# Altium schematic sheet Motorsports_BSPD_EV.SchDoc
size 381 x 241 mm; SheetNumber: 1; SheetTotal: 1
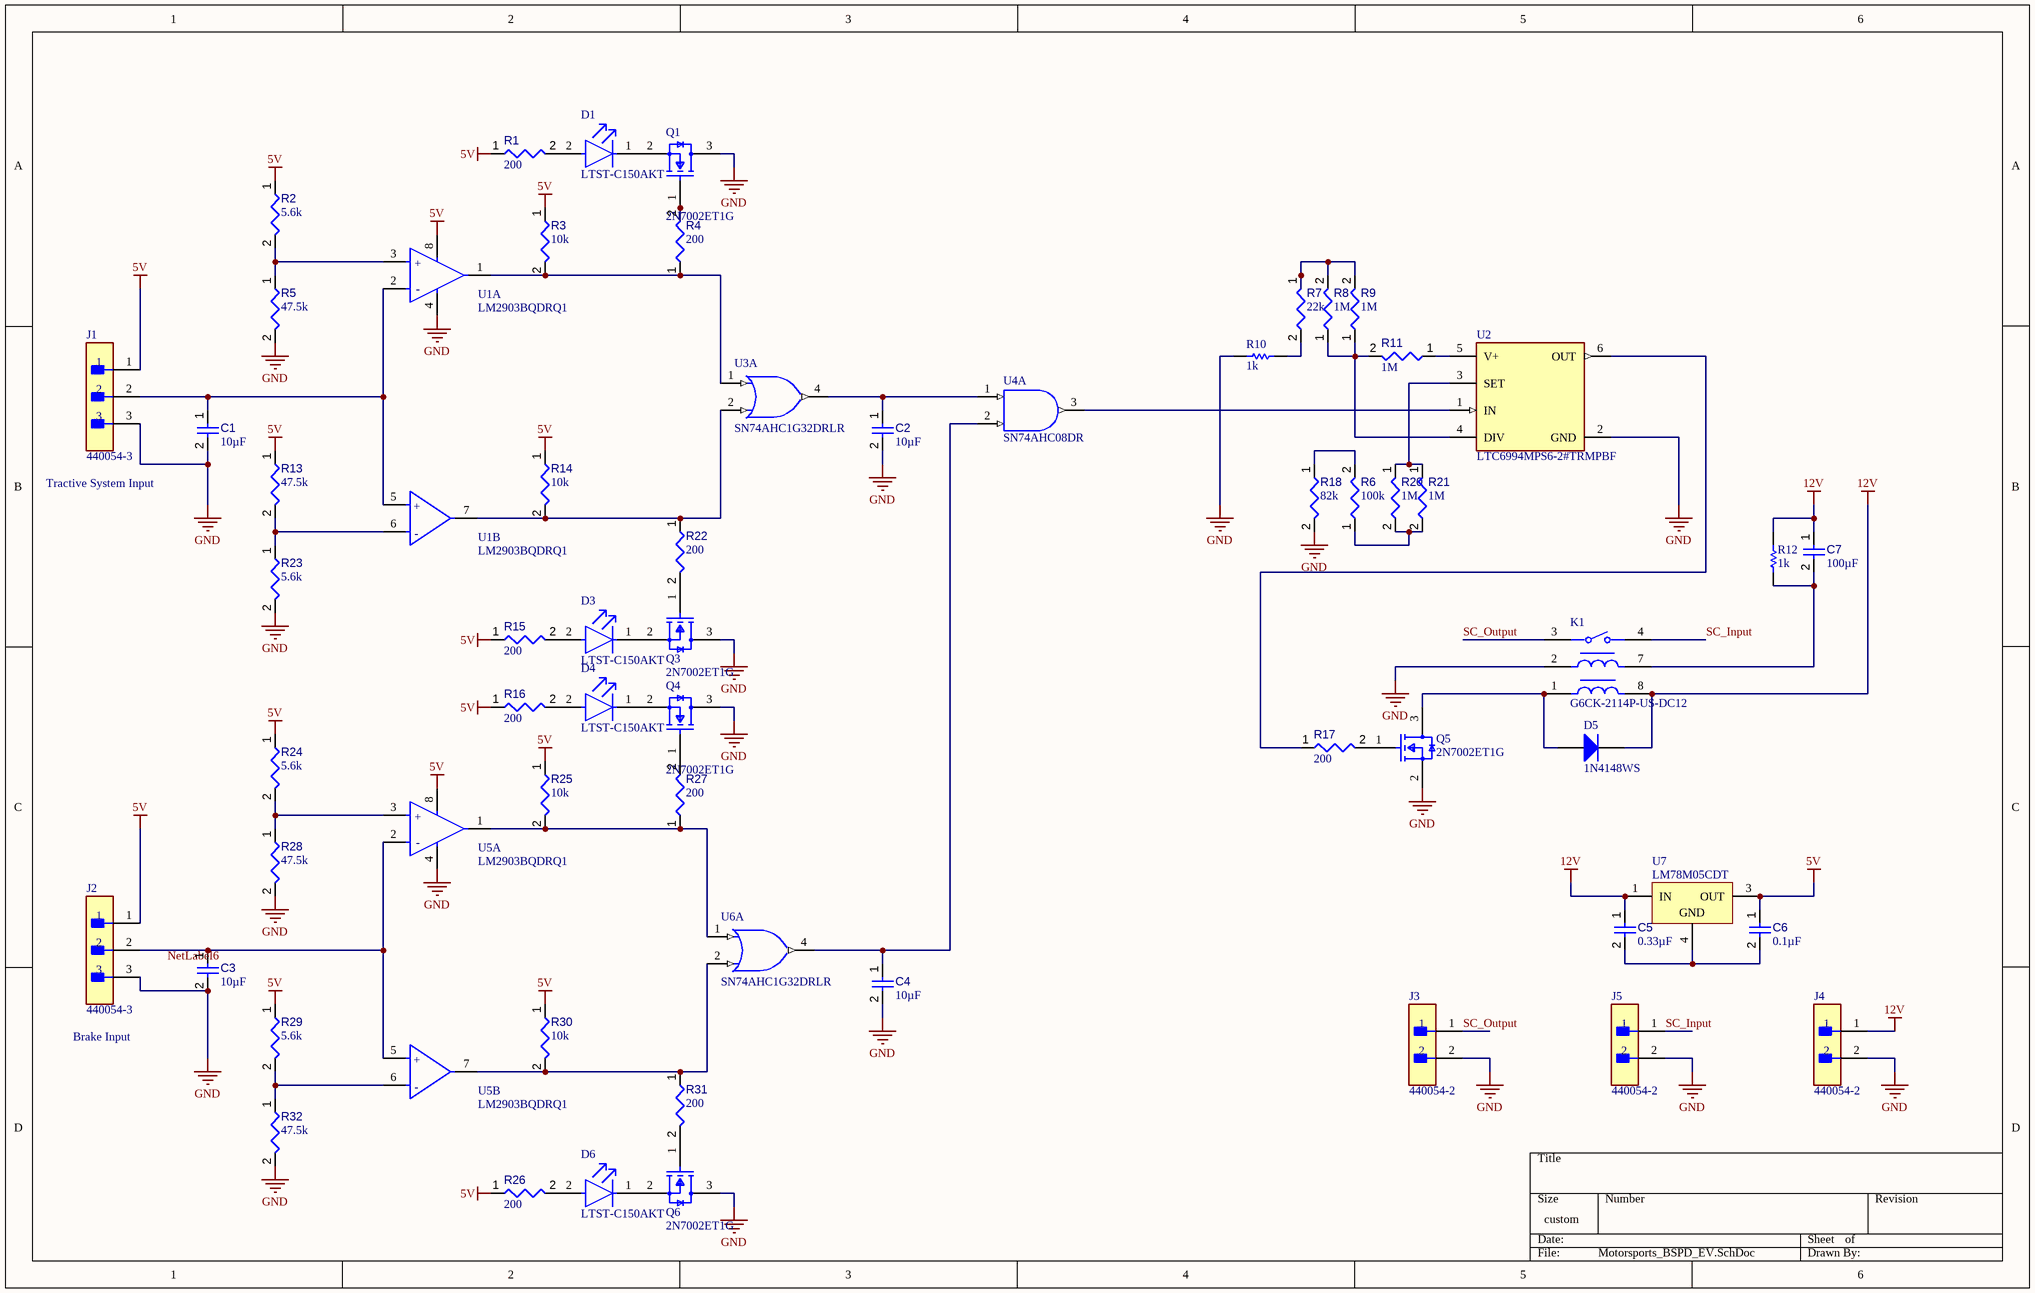
[diagram p0: Motorsports_BSPD_EV.SchDoc]

## Parts
C1  value 10µF  [CAPC0603(1608)100_L]  (hidden comment: Capacitor 10µF +/-20% 10V 0603)
C2  value 10µF  [CAPC0603(1608)100_L]  (hidden comment: Capacitor 10µF +/-20% 10V 0603)
C3  value 10µF  [CAPC0603(1608)100_L]  (hidden comment: Capacitor 10µF +/-20% 10V 0603)
C4  value 10µF  [CAPC0603(1608)100_L]  (hidden comment: Capacitor 10µF +/-20% 10V 0603)
C5  value 0.33µF  [CAPC0603(1608)100_L]  (hidden comment: Capacitor 10µF +/-20% 10V 0603)
C6  value 0.1µF  [CAPC0603(1608)100_L]  (hidden comment: Capacitor 10µF +/-20% 10V 0603)
C7  value 100µF  [CAPC0805(2012)145_L]  (hidden comment: Capacitor 100µF +/-20% 6.3V 0805)
D1  LTST-C150AKT  [FP-LTST-C150AKT-MFG]
D3  LTST-C150AKT  [FP-LTST-C150AKT-MFG]
D4  LTST-C150AKT  [FP-LTST-C150AKT-MFG]
D5  1N4148WS  [FAIR-SOD-323_V]
D6  LTST-C150AKT  [FP-LTST-C150AKT-MFG]
J1  440054-3  [FP-440054-3-MFG]
J2  440054-3  [FP-440054-3-MFG]
J3  440054-2  [FP-440054-2-MFG]
J4  440054-2  [FP-440054-2-MFG]
J5  440054-2  [FP-440054-2-MFG]
K1  G6CK-2114P-US-DC12  [FP-G6CK-2114P-US-DC12-MFG]
Q1  2N7002ET1G  [FP-318-08-IPC_A]
Q3  2N7002ET1G  [FP-318-08-IPC_A]
Q4  2N7002ET1G  [FP-318-08-IPC_A]
Q5  2N7002ET1G  [FP-318-08-IPC_A]
Q6  2N7002ET1G  [FP-318-08-IPC_A]
R1  value 200  [RESC0402(1005)_L]  (hidden comment: Resistor 200R +/-5 % 0402 63 mW)
R2  value 5.6k  [RESC0402(1005)_L]  (hidden comment: Resistor 5K6  +/-5 % 0402 63 mW)
R3  value 10k  [RESC3216X60X45ML15T20]  (hidden comment: Resistor 10k +/-1% 1206 250 mW)
R4  value 200  [RESC0402(1005)_L]  (hidden comment: Resistor 200R +/-5 % 0402 63 mW)
R5  value 47.5k  [RESC0402(1005)_L]  (hidden comment: Resistor 47K5 +/-1 % 0402 63 mW)
R6  value 100k  [RESC1005X40X25ML05T05]  (hidden comment: Resistor 100k +/-1% 0402 100 mW)
R7  value 22k  [RESC0402(1005)_L]  (hidden comment: Resistor 22K  +/-1 % 0402 63 mW)
R8  value 1M  [RESC0402(1005)_L]  (hidden comment: Resistor 1M +/-5 % 0402 63 mW)
R9  value 1M  [RESC0402(1005)_L]  (hidden comment: Resistor 1M +/-5 % 0402 63 mW)
R10  value 1k  [RESC1005X40X25ML05T05]  (hidden comment: Resistor 1k +/-1% 0402 100 mW)
R11  value 1M  [RESC0402(1005)_L]  (hidden comment: Resistor 1M +/-5 % 0402 63 mW)
R12  value 1k  [RESC1005X40X25ML05T05]  (hidden comment: Resistor 1k +/-1% 0402 100 mW)
R13  value 47.5k  [RESC0402(1005)_L]  (hidden comment: Resistor 47K5 +/-1 % 0402 63 mW)
R14  value 10k  [RESC3216X60X45ML15T20]  (hidden comment: Resistor 10k +/-1% 1206 250 mW)
R15  value 200  [RESC0402(1005)_L]  (hidden comment: Resistor 200R +/-5 % 0402 63 mW)
R16  value 200  [RESC0402(1005)_L]  (hidden comment: Resistor 200R +/-5 % 0402 63 mW)
R17  value 200  [RESC0402(1005)_L]  (hidden comment: Resistor 200R +/-5 % 0402 63 mW)
R18  value 82k  [RESC0402(1005)_L]  (hidden comment: Resistor 82K  +/-1 % 0402 63 mW)
R20  value 1M  [RESC0402(1005)_L]  (hidden comment: Resistor 1M +/-5 % 0402 63 mW)
R21  value 1M  [RESC0402(1005)_L]  (hidden comment: Resistor 1M +/-5 % 0402 63 mW)
R22  value 200  [RESC0402(1005)_L]  (hidden comment: Resistor 200R +/-5 % 0402 63 mW)
R23  value 5.6k  [RESC0402(1005)_L]  (hidden comment: Resistor 5K6  +/-5 % 0402 63 mW)
R24  value 5.6k  [RESC0402(1005)_L]  (hidden comment: Resistor 5K6  +/-5 % 0402 63 mW)
R25  value 10k  [RESC3216X60X45ML15T20]  (hidden comment: Resistor 10k +/-1% 1206 250 mW)
R26  value 200  [RESC0402(1005)_L]  (hidden comment: Resistor 200R +/-5 % 0402 63 mW)
R27  value 200  [RESC0402(1005)_L]  (hidden comment: Resistor 200R +/-5 % 0402 63 mW)
R28  value 47.5k  [RESC0402(1005)_L]  (hidden comment: Resistor 47K5 +/-1 % 0402 63 mW)
R29  value 5.6k  [RESC0402(1005)_L]  (hidden comment: Resistor 5K6  +/-5 % 0402 63 mW)
R30  value 10k  [RESC3216X60X45ML15T20]  (hidden comment: Resistor 10k +/-1% 1206 250 mW)
R31  value 200  [RESC0402(1005)_L]  (hidden comment: Resistor 200R +/-5 % 0402 63 mW)
R32  value 47.5k  [RESC0402(1005)_L]  (hidden comment: Resistor 47K5 +/-1 % 0402 63 mW)
U1  LM2903BQDRQ1  [FP-D0008A-MFG]  (parts A,B of 2)
U2  LTC6994MPS6-2#TRMPBF  [FP-S6-6-05-08-1636-MFG]
U3  SN74AHC1G32DRLR  [DRL0005A_N]  (part A of 2)
U4  SN74AHC08DR  [D0014A_L]  (part A of 5)
U5  LM2903BQDRQ1  [FP-D0008A-MFG]  (parts A,B of 2)
U6  SN74AHC1G32DRLR  [DRL0005A_N]  (part A of 2)
U7  LM78M05CDT  [NDP0003B_N]

## Nets
5V: C6.1 J1.1 J2.1 R1.1 R2.1 R3.1 R13.1 R14.1 R15.1 R16.1 R24.1 R25.1 R26.1 R29.1 R30.1 U1.8(VCC) U5.8(VCC) U7.3(OUT)
12V: C5.1 C7.1 D5.2(K) J4.1 K1.8(S+) R12.2 U7.1(IN)
GND: C1.2 C2.2 C3.2 C4.2 J1.3 J2.3 J3.2 J4.2 J5.2 K1.2(R-) Q1.3(Drain) Q3.3(Drain) Q4.3(Drain) Q5.2(Source) Q6.3(Drain) R5.2 R10.2 R18.2 R23.2 R28.2 R32.2 U1.4(GND) U2.2(GND) U5.4(GND)
SC_Input: J5.1 K1.4
SC_Output: J3.1 K1.3
NetC1_1: C1.1 J1.2 U1.2(1IN-) U1.5(2IN+)
NetC2_1: C2.1 U3.4(Y) U4.1(1A)
NetC3_1: C3.1 J2.2 U5.2(1IN-) U5.5(2IN+)
NetC4_1: C4.1 U4.2(1B) U6.4(Y)
NetC5_2: C5.2 C6.2 U7.4(GND)
NetC7_2: C7.2 K1.7(R+) R12.1
NetD1_1: D1.1(C) Q1.2(Source)
NetD1_2: D1.2(A) R1.2
NetD3_1: D3.1(C) Q3.2(Source)
NetD3_2: D3.2(A) R15.2
NetD4_1: D4.1(C) Q4.2(Source)
NetD4_2: D4.2(A) R16.2
NetD5_1: D5.1(A) K1.1(S-) Q5.3(Drain)
NetD6_1: D6.1(C) Q6.2(Source)
NetD6_2: D6.2(A) R26.2
NetQ1_1: Q1.1(Gate) R4.2
NetQ3_1: Q3.1(Gate) R22.2
NetQ4_1: Q4.1(Gate) R27.2
NetQ5_1: Q5.1(Gate) R17.2
NetQ6_1: Q6.1(Gate) R31.2
NetR2_2: R2.2 R5.1 U1.3(1IN+)
NetR3_2: R3.2 R4.1 U1.1(1OUT) U3.1(A)
NetR6_1: R6.1 R20.2 R21.2
NetR6_2: R6.2 R18.1
NetR7_1: R7.1 R8.2 R9.2
NetR7_2: R7.2 R10.1
NetR8_1: R8.1 R9.1 R11.2 U2.4(DIV)
NetR11_1: R11.1 U2.5(V+)
NetR13_2: R13.2 R23.1 U1.6(2IN-)
NetR14_2: R14.2 R22.1 U1.7(2OUT) U3.2(B)
NetR17_1: R17.1 U2.6(OUT)
NetR20_1: R20.1 R21.1 U2.3(SET)
NetR24_2: R24.2 R28.1 U5.3(1IN+)
NetR25_2: R25.2 R27.1 U5.1(1OUT) U6.1(A)
NetR29_2: R29.2 R32.1 U5.6(2IN-)
NetR30_2: R30.2 R31.1 U5.7(2OUT) U6.2(B)
NetU2_1: U2.1(IN) U4.3(1Y)

## Notes on the sheet
- Tractive System Input
- Brake Input
- Labels drawn without touching a wire or pin: NetLabel6
- (in symbol CMP-04896-000008-1, part A) +; -
- (in symbol CMP-04896-000008-1, part B) +; -

## Library data of the parts
C1-C6 = CMP-001-00075-4: Chip Capacitor, 10µF +/-20%, 10V, 0603, Thickness 1 mm; Tolerance: 10%; Voltage Rating: 10V; Max Operating Temperature: 85°C; Pins: 2; Case/Package: 0603; Mounting Technology: SMT; Min Operating Temperature: -55°C
C7 = CMP-001-00054-4: Chip Capacitor, 100µF +/-20%, 6.3V, 0805, Thickness 1.45 mm; Tolerance: 10%; Min Operating Temperature: -55°C; Max Operating Temperature: 85°C; Pins: 2; Mounting Technology: SMT; Case/Package: 0805; Voltage Rating: 6.3V
D1 D3 D4 D6 = CMP-22017-000004-1: LED AMBER CLEAR SMD; Manufacturer: Lite-On; Luminous Intensity: 6mcd; Viewing Angle: 130°; Wavelength: 602nm; Reverse Voltage: 5V; Forward Current: 30mA; Led Orientation: Top View; Power Dissipation: 100mW; Peak Emmision Wavelength: 610nm; Forward Voltage: 2.1V; ComponentLink2Description: Datasheet; Device Class L3: unset; Height: 1.2mm; RoHS: TRUE; ComponentLink2URL: https://media.digikey.com/pdf/Data%20Sheets/Lite-On%20PDFs/LTST-C150AKT.pdf; Temperature: -55°C to +85°C; Package: 0; Automotive: No; Manufacturer Part Number: LTST-C150AKT; Temperature Range Low: -55°C; Device Class L2: LEDs; Device Class L1: Optoelectronics; Octopart: https://octopart.com/ltst-c150akt-lite-on-549804; Digikey Description: LED AMBER CLEAR SMD; Colour: Amber; Category: Diode; Mouser Description: Standard LEDs - SMD Amber Clear 602nm; Lead Free: Yes; Temperature Range High: +85°C
D5 = CMP-004-00001-2: Small Signal Diode, 75 V, 0.15 A, -55 to 150 degC, 2-Pin SOD-323, RoHS, Tape and Reel; Manufacturer: Fairchild; Recovery Time: 4ns; Forward Voltage: 1V; Peak Reverse Current: 5uA; Forward Current: 150mA; Capacitance: -323f; Datasheet URL: https://www.fairchildsemi.com/datasheets/1N/1N4148WS.pdf; Package Reference: SOD-323; Package Description: 2-Pin Small Outline Diode Flat Lead, Body 1.7 x 1.25 mm; Case/Package: SOD-323; Mounting Technology: SM; Manufacturer URL: https://www.fairchildsemi.com/; Pins: 2; Packaging: TapeandReel; Package Quantity: 3000; Min Operating Temperature: -55°C; RoHS Compliant: True; Max Operating Temperature: 150°C; Datasheet Version: Rev. 1.2, 03/2015
J1 J2 = CMP-03369-000008-1: CONN HEADER VERT 3POS 2MM; Manufacturer: TE Connectivity; Voltage Rating: 250V; Number Of Contacts: 3; Conn Gender: Male; Conn Orientation: Vertical; Current Rating: 3A; Octopart: https://octopart.com/440054-3-te+connectivity-40394845; Device Class L3: unset; Device Class L1: Connectors; Number Of Rows: 1; Temperature: -25°C to +105°C; Temperature Range Low: -25°C; Automotive: No; Package: 0; Manufacturer Part Number: 440054-3; ComponentLink2URL: https://www.te.com/usa-en/product-440054-3.datasheet.pdf; Device Class L2: Headers and Wire Housings; Temperature Range High: +105°C; Digikey Description: CONN HEADER VERT 3POS 2MM; Contact Material: Tin,Nickel; Footprint Url: https://www.te.com/commerce/DocumentDelivery/DDEController?Action=showdoc&DocId=Customer+Drawing%7F440054%7FF6%7Fpdf%7FEnglish%7FENG_CD_440054_F6.pdf%7F440054-3; RoHS: TRUE; ComponentLink2Description: Datasheet; Mouser Description: Headers & Wire Housings 3 POS HDR VERT 2.0mm; Lead Free: Yes; Category: Conn; Height: 6.35mm; Pitch: 2mm
J3-J5 = CMP-03369-000005-1: CONN HEADER VERT 2POS 2MM; Manufacturer: TE Connectivity; Conn Gender: Male; Conn Orientation: Vertical; Voltage Rating: 250V; Number Of Contacts: 2; Current Rating: 3A; ComponentLink2Description: Datasheet; Temperature Range Low: -25°C; Contact Material: Tin,Nickel; Device Class L3: unset; Digikey Description: CONN HEADER VERT 2POS 2MM; Temperature: -25°C to +85°C; Mouser Description: Headers & Wire Housings 2.0mm HDR 2pos VERT HPI; Manufacturer Part Number: 440054-2; Package: 440054-2; Lead Free: Yes; ComponentLink2URL: https://www.te.com/usa-en/product-440054-2.datasheet.pdf; Number Of Rows: 1; Octopart: https://octopart.com/440054-2-te+connectivity-40237927; Category: Conn; Temperature Range High: +85°C; Footprint Url: https://www.te.com/commerce/DocumentDelivery/DDEController?Action=showdoc&DocId=Customer+Drawing%7F440054%7FF6%7Fpdf%7FEnglish%7FENG_CD_440054_F6.pdf%7F440054-2; Pitch: 2mm; Device Class L1: Connectors; RoHS: TRUE; Height: 6.35mm; Device Class L2: Headers and Wire Housings; Automotive: No
K1 = CMP-08822-000141-1: RELAY GEN PURPOSE DPST 8A 12V; Coil Type: Latching, Dual Coil; Max Voltage Rating (DC): 125V; Operate Time: 10ms; Coil Current: 23.3mA; Voltage Rating (AC): 250V; Coil Power: 280mW; Throw Configuration: SPST; Coil Resistance: 514R; Relay Type: General Purpose; Weight: 5.6g; Lead Free: Lead Free; Number of Pins: 8; Coil Voltage (DC): 12V; Termination: PC Pin; Radiation Hardening: No; Contact Material: Silver; Length: 20mm; Max Operating Temperature: 70°C; Packaging: Bulk; Max Voltage Rating (AC): 250V; Max Current Rating: 8A; Release Time: 10ms; Series: G6C; Contact Current Rating: 8A; Depth: 15mm; Package Quantity: 1000; Mount: Through Hole; Min Operating Temperature: -25°C
Q1 Q3-Q6 = CMP-1058-00769-2: MOSFET N-CH 60V 260MA SOT-23; On-State Resistance: 2.5R; Turn-Off Delay Time: 4.8ns; Nominal Vgs: 1V; Element Configuration: Single; Rise Time: 1.2ns; Input Capacitance: 26.7pF; Number of Elements: 1; Turn-On Delay Time: 1.7ns; Gate to Source Voltage (Vgs): 20V; Max Power Dissipation: 300mW; Drain to Source Breakdown Voltage: 60V; Max Operating Temperature: 150°C; REACH SVHC: No SVHC; Case/Package: SOT-23-3; Lead Free: Lead Free; Length: 2.9mm; Height: 0.94mm; Package Quantity: 3000; Min Operating Temperature: -55°C; Radiation Hardening: No; Packaging: Tape and Reel; Fall Time: 1.2ns; Drain to Source Resistance: 2.5R; Halogen Free: Halogen Free; Threshold Voltage: 1V; Number of Pins: 3; Continuous Drain Current (ID): 260mA; Rds On Max: 2.5R; Power Dissipation: 300mW; Width: 1.3mm
R1 R4 R15-R17 R22 R26 R27 R31 = CMP-009-00161-3: Chip Resistor, 200 Ohms, +/-5 %, 63 mW, -55 to 155 degC, 0402; Power: 63mW; Tolerance: 5%; Min Operating Temperature: -55°C; Case/Package: 0402; Max Operating Temperature: 155°C; Pins: 2
R2 R23 R24 R29 = CMP-009-00136-3: Chip Resistor, 5,6 kOhms, +/-5 %, 63 mW, -55 to 155 degC, 0402; Power: 63mW; Tolerance: 5%; Max Operating Temperature: 155°C; Case/Package: 0402; Min Operating Temperature: -55°C; Pins: 2
R3 R14 R25 R30 = CMP-009-00016-5: Chip Resistor, 10 KOhm, +/- 1%, 0.25 W, -55 to 155 degC, 1206 (3216 Metric); Power: 250mW; Voltage Rating: 200V; Pins: 2; Max Operating Temperature: 155°C; Tolerance: 1%; RoHS Compliant: True; Case/Package: 1206; Min Operating Temperature: -55°C; Mounting Technology: SM
R5 R13 R28 R32 = CMP-009-00137-3: Chip Resistor, 47,5 kOhms, +/-1 %, 63 mW, -55 to 155 degC, 0402; Power: 63mW; Tolerance: 1%; Pins: 2; Case/Package: 0402; Min Operating Temperature: -55°C; Max Operating Temperature: 155°C
R6 = CMP-009-00022-5: Chip Resistor, 100 KOhm, +/- 1%, 0.1 W, -55 to 155 degC, 0402 (1005 Metric); Power: 100mW; Voltage Rating: 50V; Mounting Technology: SM; Pins: 2; Min Operating Temperature: -55°C; Tolerance: 1%; RoHS Compliant: True; Case/Package: 0402; Max Operating Temperature: 155°C
R7 = CMP-009-00123-3: Chip Resistor, 22 kOhms, +/-1 %, 63 mW, -55 to 155 degC, 0402; Power: 63mW; Tolerance: 1%; Pins: 2; Min Operating Temperature: -55°C; Max Operating Temperature: 155°C; Case/Package: 0402
R8 R9 R11 R20 R21 = CMP-009-00151-3: Chip Resistor, 1 MOhms, +/-5 %, 63 mW, -55 to 155 degC, 0402; Power: 63mW; Tolerance: 5%; Pins: 2; Min Operating Temperature: -55°C; Case/Package: 0402; Max Operating Temperature: 155°C
R10 R12 = CMP-009-00009-5: Chip Resistor, 1 KOhm, +/- 1%, 0.1 W, -55 to 155 degC, 0402 (1005 Metric); Power: 100mW; Voltage Rating: 50V; Min Operating Temperature: -55°C; Max Operating Temperature: 155°C; RoHS Compliant: True; Mounting Technology: SM; Pins: 2; Tolerance: 1%; Case/Package: 0402
R18 = CMP-009-00140-3: Chip Resistor, 82 kOhms, +/-1 %, 63 mW, -55 to 155 degC, 0402; Power: 63mW; Tolerance: 1%; Pins: 2; Case/Package: 0402
U1 U5 = CMP-04896-000008-1: Automotive Dual Comparators; Manufacturer: Texas Instruments; Input Offset Voltage: 0.37mV; Automotive Grade: Grade 1; Max Supply Voltage: 36V; Voltage Gain: 200V/mV; Nominal Supply Current: 400-550uA; Response Time: 1us; Input Bias Current: 0.0035uA; Output Current Per Channel: 21mA; Min Supply Voltage: 3V; Standoff Height: 0.11mm; Number Of Channels: 2; Package: D0008A; Lead Free: Yes; Ambient Temperature Range Low: -40°C; ComponentLink2Description: Datasheet; RoHS: TRUE; ComponentLink2URL: http://www.ti.com/lit/ds/symlink/lm2903-q1.pdf; Device Class L1: Integrated Circuits (ICs); Temperature: -40°C to +125°C; Octopart: https://octopart.com/lm2903bqdrq1-texas+instruments-107383907; Automotive: Yes; Temperature Range Low: -40°C; Device Class L2: Linear ICs; Height: 1.75mm; Temperature Range High: +125°C; Device Class L3: Comparators; Manufacturer Part Number: LM2903BQDRQ1; Category: IC; Ambient Temperature Range High: +125°C
U2 = CMP-09075-000007-1: IC DELAY LINE 8TAP PROG TSOT23-6; Number of Taps/Steps: 8; Number of Pins: 23; Package Quantity: 500; Case/Package: SOT-23-6; Mount: Surface Mount; RoHS Compliant: Yes; Packaging: Tape and Reel; Lead Free: Lead Free; Series: TimerBlox®; Max Operating Temperature: 125°C; Min Operating Temperature: -55°C
U3 U6 = CMP-0859-00783-3: Single 2-Input Positive-OR Gate, DRL0005A, LARGE T&R; Manufacturer: Texas Instruments; Logic: True; 3-State Output: No; VCC(Min)(V): 2; Output Type: CMOS; Output Drive (IOL/IOH)(Max)(mA): 50/-50; F @ Nom Voltage(Max)(Mhz): 75; Gate Type: OR; Technology Family: AHC; ICC @ Nom Voltage(Max)(mA): 0.01; Rating: Catalog; VCC(Max)(V): 5.5; Voltage(Nom)(V): 3.3,5; tpd @ Nom Voltage(Max)(ns): 13,8.5; Bits(#): 1; Sub-Family: OR Gate; Input Type: CMOS; Operating Temperature Range(C): -40 to 125; Generic Part Number: SN74AHC1G32; DatasheetVersion: SCLS317O; Schmitt Trigger: No; PackageReference: DRL0005A
U4 = CMP-0777-00049-3: Quadruple 2-Input Positive-AND Gates, D0014A, LARGE T&R; Manufacturer: Texas Instruments; Rating: Catalog; F @ Nom Voltage(Max)(Mhz): 110; Schmitt Trigger: No; Voltage(Nom)(V): 3.3,5; VCC(Max)(V): 5.5; Input Type: CMOS; tpd @ Nom Voltage(Max)(ns): 14,9; VCC(Min)(V): 2; ICC @ Nom Voltage(Max)(mA): 0.02; Output Drive (IOL/IOH)(Max)(mA): -50/50; Bits(#): 4; Technology Family: AHC; DatasheetVersion: SCLS236I; Operating Temperature Range(C): -40 to 125; Generic Part Number: SN74AHC08; Output Type: CMOS; PackageReference: D0014A
U7 = CMP-0062-00202-3: 3-Terminal Positive Voltage Regulators, 3-pin TO-252; Manufacturer: Texas Instruments; CompType: LDO IC; PackageTopMarking: NSUZXYTT*LM78M05*CDT; PowerWise: N; PackageDescription: TO252, Molded, Jedec, 6.8 x 6.10 x 2.30mm Body, 3 Lead, 2.28mm Pitch, Surface Mount; RoHS: N; Code_JEDEC: TO-252-AA; PinCount: 3; ComponentLink1Description: Datasheet URL; ComponentLink1URL: http://www.ti.com/general/docs/lit/getliterature.tsp?genericPartNumber=LM78M05&fileType=pdf; PackageReference: NDP0003B